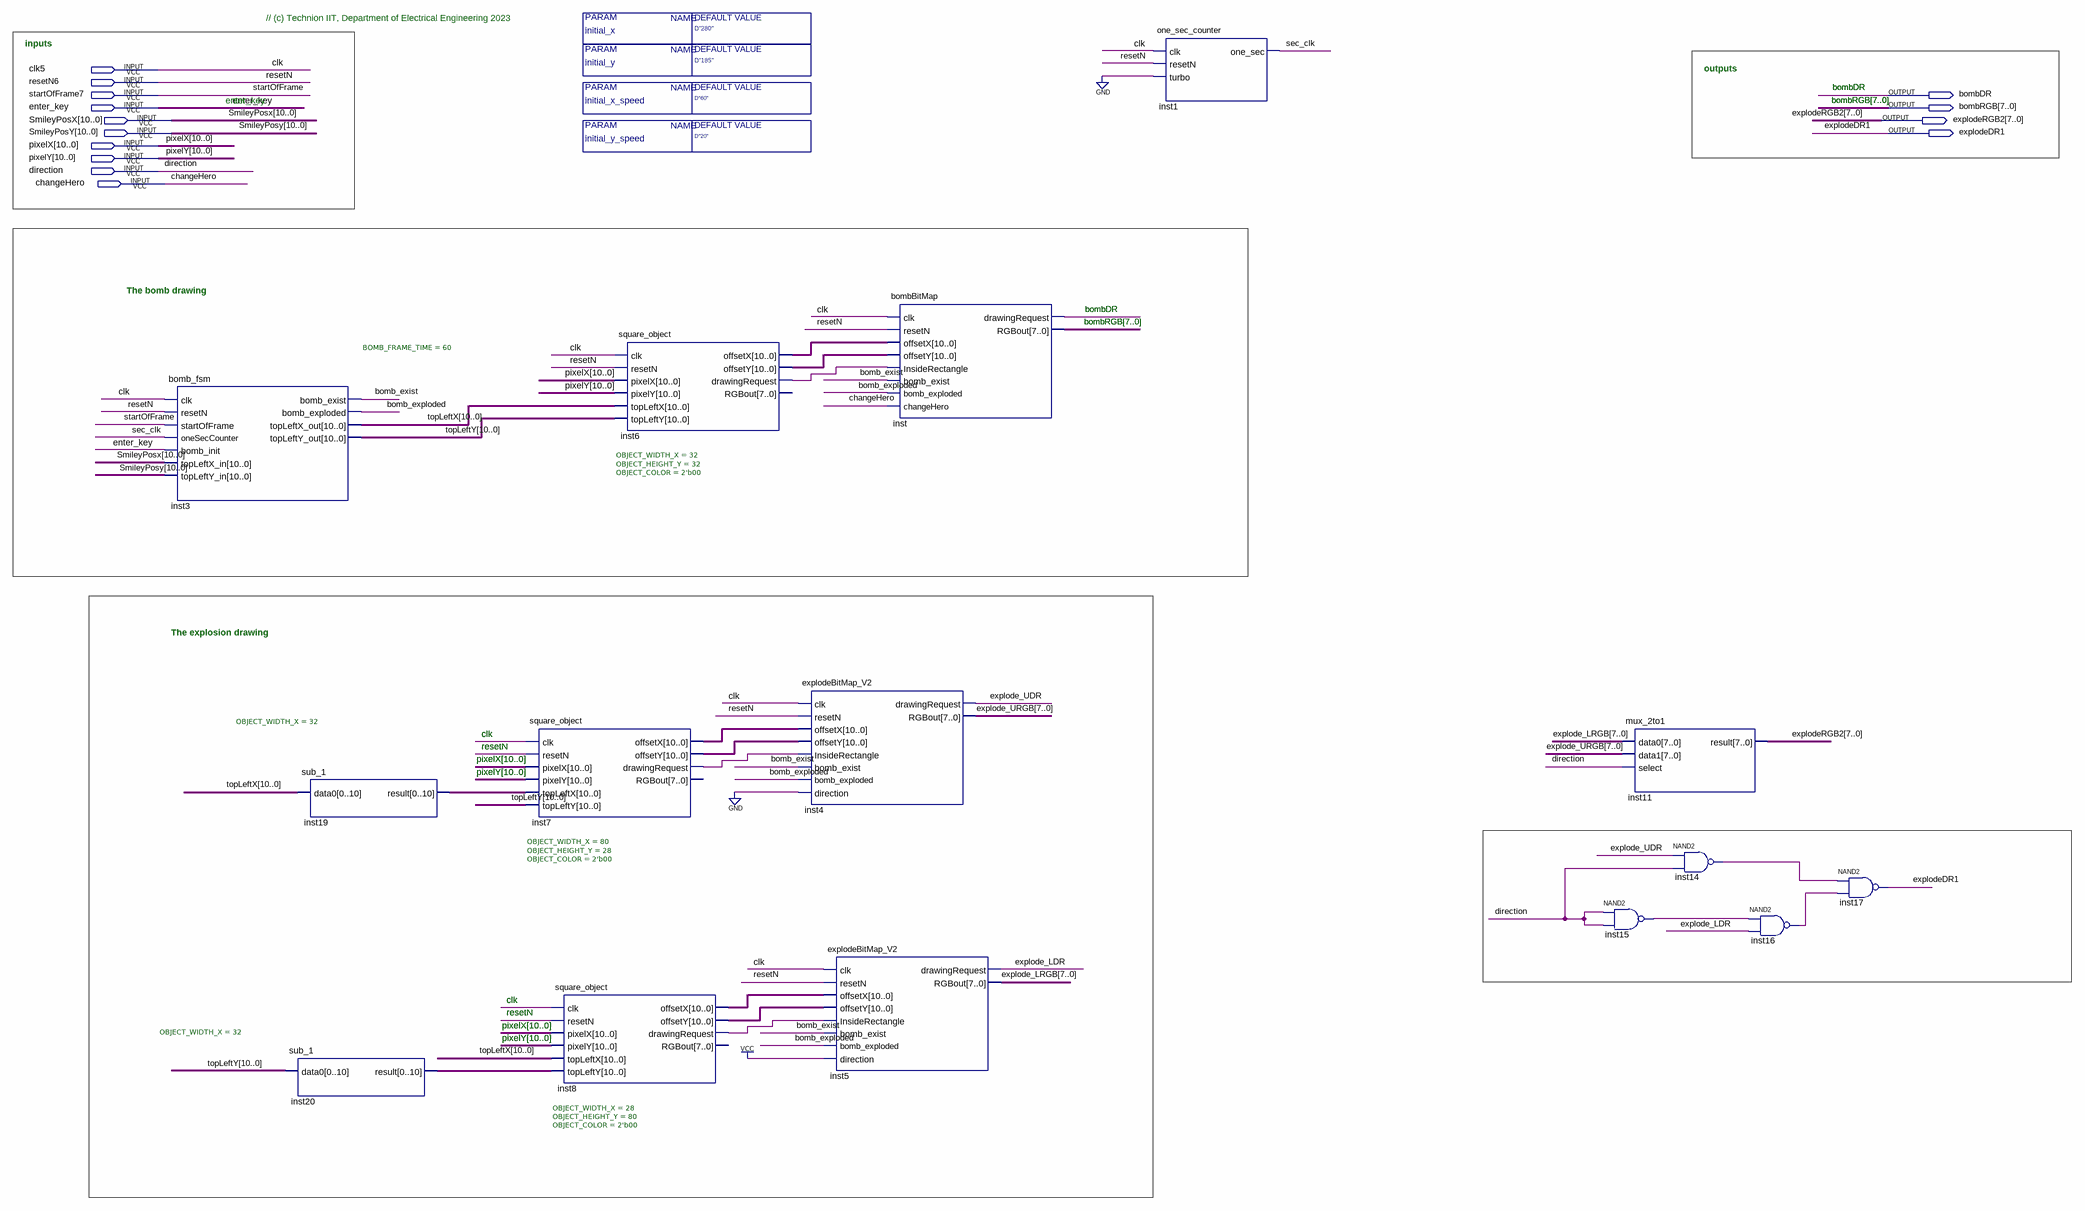
[diagram p0: schematic sheet]
// Quartus schematic Bomb_Block_T.bdf as structural Verilog: 15 symbols, 14 pins
module Bomb_Block_T #(parameter initial_x = "D\"280\"", parameter initial_y = "D\"185\"", parameter initial_x_speed = "D\"60\"", parameter initial_y_speed = "D\"20\"") (
  input  clk5,
  input  resetN6,
  input  startOfFrame7,
  input  enter_key,
  input  [10:0] SmileyPosX,
  input  [10:0] SmileyPosY,
  input  [10:0] pixelX,
  input  [10:0] pixelY,
  input  direction,
  input  changeHero,
  output bombDR,
  output [7:0] bombRGB,
  output [7:0] explodeRGB2,
  output explodeDR1
);

  wire bomb_exist, bomb_exploded, explode_LDR, explode_UDR, inst6_drawingrequest, inst7_drawingrequest,
       inst8_drawingrequest, inst14_out, inst15_out, inst16_out, sec_clk;
  wire [7:0] explode_LRGB, explode_URGB;
  wire [10:0] inst6_offsetx, inst6_offsety, inst7_offsetx, inst7_offsety, inst8_offsetx, inst8_offsety,
       inst19_result, inst20_result, topLeftX, topLeftY;

  bomb_fsm #(.BOMB_FRAME_TIME(60)) inst3 (
    .clk(clk5), .resetN(resetN6), .startOfFrame(startOfFrame7), .oneSecCounter(sec_clk),
    .bomb_init(enter_key), .topLeftX_in(SmileyPosX), .topLeftY_in(SmileyPosY), .bomb_exist(bomb_exist),
    .bomb_exploded(bomb_exploded), .topLeftX_out(topLeftX), .topLeftY_out(topLeftY));
  sub_1 #(.OBJECT_WIDTH_X(32)) inst19 (.data0(topLeftX), .result(inst19_result));
  sub_1 #(.OBJECT_WIDTH_X(32)) inst20 (.data0(topLeftY), .result(inst20_result));
  square_object #(.OBJECT_WIDTH_X(80), .OBJECT_HEIGHT_Y(28), .OBJECT_COLOR(2'b00)) inst7 (
    .clk(clk5), .resetN(resetN6), .pixelX(pixelX), .pixelY(pixelY), .topLeftX(inst19_result),
    .topLeftY(topLeftY), .offsetX(inst7_offsetx), .offsetY(inst7_offsety),
    .drawingRequest(inst7_drawingrequest));  // open: RGBout
  square_object #(.OBJECT_WIDTH_X(28), .OBJECT_HEIGHT_Y(80), .OBJECT_COLOR(2'b00)) inst8 (
    .clk(clk5), .resetN(resetN6), .pixelX(pixelX), .pixelY(pixelY), .topLeftX(topLeftX),
    .topLeftY(inst20_result), .offsetX(inst8_offsetx), .offsetY(inst8_offsety),
    .drawingRequest(inst8_drawingrequest));  // open: RGBout
  square_object #(.OBJECT_WIDTH_X(32), .OBJECT_HEIGHT_Y(32), .OBJECT_COLOR(2'b00)) inst6 (
    .clk(clk5), .resetN(resetN6), .pixelX(pixelX), .pixelY(pixelY), .topLeftX(topLeftX), .topLeftY(topLeftY),
    .offsetX(inst6_offsetx), .offsetY(inst6_offsety), .drawingRequest(inst6_drawingrequest));  // open: RGBout
  explodeBitMap_V2 inst4 (
    .clk(clk5), .resetN(resetN6), .offsetX(inst7_offsetx), .offsetY(inst7_offsety),
    .InsideRectangle(inst7_drawingrequest), .bomb_exist(bomb_exist), .bomb_exploded(bomb_exploded),
    .direction(1'b0), .drawingRequest(explode_UDR), .RGBout(explode_URGB));
  explodeBitMap_V2 inst5 (
    .clk(clk5), .resetN(resetN6), .offsetX(inst8_offsetx), .offsetY(inst8_offsety),
    .InsideRectangle(inst8_drawingrequest), .bomb_exist(bomb_exist), .bomb_exploded(bomb_exploded),
    .direction(1'b1), .drawingRequest(explode_LDR), .RGBout(explode_LRGB));
  bombBitMap inst (
    .clk(clk5), .resetN(resetN6), .offsetX(inst6_offsetx), .offsetY(inst6_offsety),
    .InsideRectangle(inst6_drawingrequest), .bomb_exist(bomb_exist), .bomb_exploded(bomb_exploded),
    .changeHero(changeHero), .drawingRequest(bombDR), .RGBout(bombRGB));
  one_sec_counter inst1 (.clk(clk5), .resetN(resetN6), .turbo(1'b0), .one_sec(sec_clk));
  mux_2to1 inst11 (.data0(explode_LRGB), .data1(explode_URGB), .select(direction), .result(explodeRGB2));
  nand inst15 (inst15_out, direction, direction);
  nand inst14 (inst14_out, explode_UDR, direction);
  nand inst16 (inst16_out, inst15_out, explode_LDR);
  nand inst17 (explodeDR1, inst14_out, inst16_out);

  // Other names for the same wires on the sheet: clk = clk5; resetN = resetN6; startOfFrame = startOfFrame7

  // Notes on the sheet:
  //   // (c) Technion IIT, Department of Electrical Engineering 2023
  //   inputs
  //   outputs
  //   bombDR
  //   bombDR
  //   enter_key
  //   bombRGB[7..0]
  //   bombRGB[7..0]
  //   The bomb drawing
  //   bombDR
  //   bombRGB[7..0]
  //   The explosion drawing
  //   clk
  //   resetN
  //   pixelX[10..0]
  //   pixelY[10..0]
  //   clk
  //   resetN
  //   pixelX[10..0]
  //   pixelY[10..0]
endmodule
